# EAGLE schematic Jufo25 (EAGLE 9.6.2)
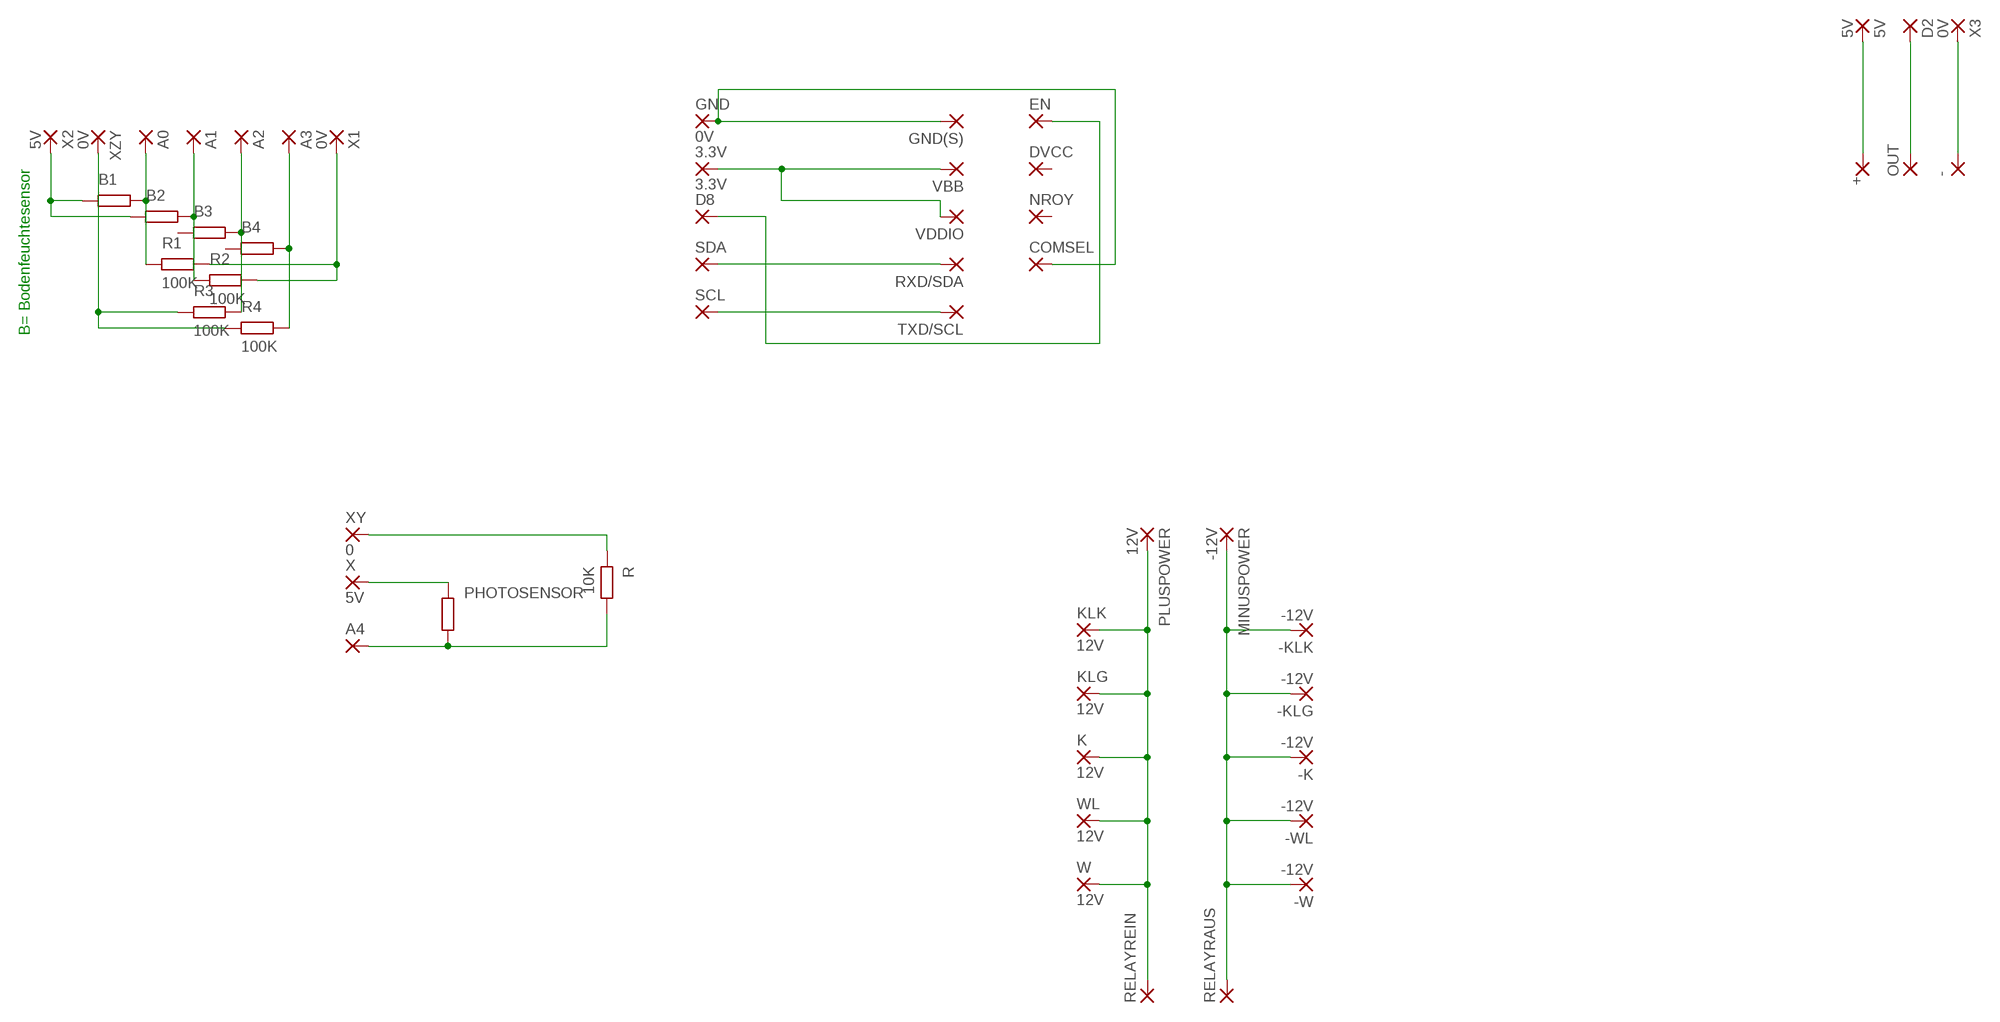
[diagram p0: schematic, sheet 1]

## Parts
3.3V  3.3V  WIREPAD1,6/0,8  [1,6/0,8]
5V  5V  WIREPAD1,6/0,8  [1,6/0,8]
+  WIREPAD1,6/0,8  [1,6/0,8]
-  WIREPAD1,6/0,8  [1,6/0,8]
-K  -12V  WIREPAD1,6/0,8  [1,6/0,8]
-KLG  -12V  WIREPAD1,6/0,8  [1,6/0,8]
-KLK  -12V  WIREPAD1,6/0,8  [1,6/0,8]
-W  -12V  WIREPAD1,6/0,8  [1,6/0,8]
-WL  -12V  WIREPAD1,6/0,8  [1,6/0,8]
A0  WIREPAD1,6/0,8  [1,6/0,8]
A1  WIREPAD1,6/0,8  [1,6/0,8]
A2  WIREPAD1,6/0,8  [1,6/0,8]
A3  WIREPAD1,6/0,8  [1,6/0,8]
A4  WIREPAD1,6/0,8  [1,6/0,8]
B1  R  (no package)
B2  R  (no package)
B3  R  (no package)
B4  R  (no package)
COMSEL  WIREPAD1,6/0,8  [1,6/0,8]
D2  WIREPAD1,6/0,8  [1,6/0,8]
D8  WIREPAD1,6/0,8  [1,6/0,8]
DVCC  WIREPAD1,6/0,8  [1,6/0,8]
EN  WIREPAD1,6/0,8  [1,6/0,8]
GND  0V  WIREPAD1,6/0,8  [1,6/0,8]
GND(S)  WIREPAD1,6/0,8  [1,6/0,8]
K  12V  WIREPAD1,6/0,8  [1,6/0,8]
KLG  12V  WIREPAD1,6/0,8  [1,6/0,8]
KLK  12V  WIREPAD1,6/0,8  [1,6/0,8]
MINUSPOWER  -12V  WIREPAD1,6/0,8  [1,6/0,8]
NROY  WIREPAD1,6/0,8  [1,6/0,8]
OUT  WIREPAD1,6/0,8  [1,6/0,8]
PHOTOSENSOR  R  (no package)
PLUSPOWER  12V  WIREPAD1,6/0,8  [1,6/0,8]
R  10K  R  (no package)
R1  100K  R  (no package)
R2  100K  R  (no package)
R3  100K  R  (no package)
R4  100K  R  (no package)
RELAYRAUS  WIREPAD1,6/0,8  [1,6/0,8]
RELAYREIN  WIREPAD1,6/0,8  [1,6/0,8]
RXD/SDA  WIREPAD1,6/0,8  [1,6/0,8]
SCL  WIREPAD1,6/0,8  [1,6/0,8]
SDA  WIREPAD1,6/0,8  [1,6/0,8]
TXD/SCL  WIREPAD1,6/0,8  [1,6/0,8]
VBB  WIREPAD1,6/0,8  [1,6/0,8]
VDDIO  WIREPAD1,6/0,8  [1,6/0,8]
W  12V  WIREPAD1,6/0,8  [1,6/0,8]
WL  12V  WIREPAD1,6/0,8  [1,6/0,8]
X  5V  WIREPAD1,6/0,8  [1,6/0,8]
X1  0V  WIREPAD1,6/0,8  [1,6/0,8]
X2  5V  WIREPAD1,6/0,8  [1,6/0,8]
X3  0V  WIREPAD1,6/0,8  [1,6/0,8]
XY  0  WIREPAD1,6/0,8  [1,6/0,8]
XZY  0V  WIREPAD1,6/0,8  [1,6/0,8]

## Nets
N$1: R.1 XY.1(P)
N$2: -K.1(P) -KLG.1(P) -KLK.1(P) -W.1(P) -WL.1(P) MINUSPOWER.1(P) RELAYRAUS.1(P)
N$3: K.1(P) KLG.1(P) KLK.1(P) PLUSPOWER.1(P) RELAYREIN.1(P) W.1(P) WL.1(P)
N$4: A4.1(P) PHOTOSENSOR.2 R.2
N$5: PHOTOSENSOR.1 X.1(P)
N$6: R1.2 R2.2 X1.1(P)
N$7: B1.1 B2.1 X2.1(P)
N$8: R3.1 R4.1 XZY.1(P)
N$9: A0.1(P) B1.2 R1.1
N$10: A1.1(P) B2.2 R2.1
N$11: A2.1(P) B3.2 R3.2
N$12: A3.1(P) B4.2 R4.2
N$13: -.1(P) X3.1(P)
N$14: D2.1(P) OUT.1(P)
N$15: 5V.1(P) +.1(P)
N$16: COMSEL.1(P) GND(S).1(P) GND.1(P)
N$18: D8.1(P) EN.1(P)
N$19: 3.3V.1(P) VBB.1(P) VDDIO.1(P)
N$21: RXD/SDA.1(P) SDA.1(P)
N$22: SCL.1(P) TXD/SCL.1(P)
Unconnected: B3.1 B4.1 DVCC.1(P) NROY.1(P)

## Notes on the sheet
- B= Bodenfeuchtesensor

## Library data of the parts
3.3V 5V + - -K -KLG -KLK -W -WL A0 A1-A4 COMSEL D2 D8 DVCC EN GND GND(S) K KLG KLK MINUSPOWER NROY OUT PLUSPOWER RELAYRAUS RELAYREIN RXD/SDA SCL SDA TXD/SCL VBB VDDIO W WL X X1-X3 XY XZY = wirepad:WIREPAD: Wire PAD connect wire on PCB
B1-B4 PHOTOSENSOR R R1-R4 = ngspice-simulation:R: RESISTOR